# Altium schematic sheet LB-char-coilDriver.SchDoc
size A4
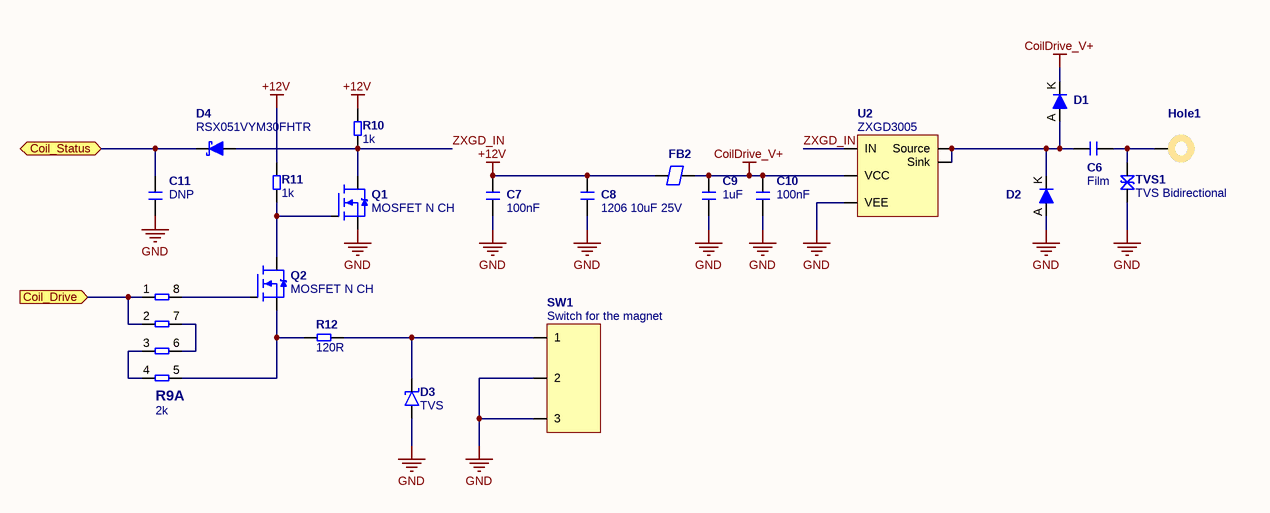
[diagram p0: LB-char-coilDriver.SchDoc]

## Parts
C6  Film  [Cap Film 5mm pitch, 7.2x7.2mm]
C7  100nF  [C0603_N]
C8  1206 10uF 25V  [C1206_N]
C9  1uF  [C0603_N]
C10  100nF  [C0603_N]
C11  DNP  [C0603_N]
D1  RSX051VYM30FHTR  [SOD323F]  (value not drawn)
D2  RSX051VYM30FHTR  [SOD323F]  (value not drawn)
D3  TVS  [SOD323F-Comchip Variant]
D4  RSX051VYM30FHTR  [SOD323F]
FB2  Ferrite Bead  [F0603_N]  (value not drawn)
Hole1  Hole  [Insert-Thread-SMD-M2]  (value not drawn)
Q1  MOSFET N CH  [SOT23_N]
Q2  MOSFET N CH  [SOT23_N]
R9  value 2k  [YC164]  (parts A,B,C,D of 4)
R10  1k  [R0603]
R11  1k  [R0603]
R12  120R  [R0603]
SW1  Switch for the magnet  [Linobyte - MagnetSwitch]
TVS1  TVS Bidirectional  [DO214AC SMA]
U2  ZXGD3005  [SOT23-6_N]

## Ports
Coil_Drive (in), Coil_Status (bidir)

## Nets
+12V: C7.1 C8.1 FB2.2 R10.2 R11.2
CoilDrive_V+: C9.1 C10.1 D1.K FB2.1 U2.1(VCC)
GND: C7.2 C8.2 C9.2 C10.2 C11.2 D2.A D3.1 Q1.3(S) SW1.2 SW1.3 TVS1.2 U2.3(VEE)
Coil_Drive: R9.1 R9.2 ; port Coil_Drive
Coil_Status: C11.1 D4.K ; port Coil_Status
ZXGD_IN: D4.A Q1.2(D) R10.1 U2.2(IN)
NetC6_1: C6.1 Hole1.1 TVS1.1
NetC6_2: C6.2 D1.A D2.K U2.4(Sink) U2.6(Source)
NetD3_2: D3.2 R12.2 SW1.1
NetQ1_1: Q1.1(G) Q2.2(D) R11.1
NetQ2_1: Q2.1(G) R9.8
NetQ2_3: Q2.3(S) R9.5 R12.1
NetR9_3: R9.3 R9.4
NetR9_6: R9.6 R9.7

## Library data of the parts
C6 = Capacitor - Film
C7-C11 = Capacitor: Capacitor MLCC; Manufacturer: Yageo; Manufacturer Part Number: CC0603KRX7R9BB104; Tolerance (%): 10; Category: Capacitor; Package: 0603; Supplier Part Number 1: 1362556; Supplier 1: Farnell; ComponentLink1URL: http://www.yageo.com; ComponentLink1Description: Manufacturer Website; Voltage Rating (Volts): *; Supplier 2: Digi-Key; Supplier Part Number 2: 311-1344-1-ND
  C7 C10: Value: 100nF
  C8 C9: Value: *
  C11: Value: DNP
D1 D2 = Diode
D4 = Diode Schottky
R9 = Resistor Array - 4P
R10-R12 = Resistor: Published: 17-Dec-2003; LatestRevisionDate: 19-Mar-2004; LatestRevisionNote: Silkscreen size reduced.; PackageDocument: Mar-2003; PackageReference: 3-0603; Publisher: Altium Limited; Code_IPC: 1608 [0603]; ComponentLink1Description: Manufacturer Link; ComponentLink1URL: http://www.panasonic.com/industrial/components/resistive_products.htm; ComponentLink2Description: Datasheet; ComponentLink2URL: http://www.panasonic.com/industrial/components/pdf/AOA0000CE2.pdf
  R10 R11: Value: 1k
  R12: Value: 120R
SW1 = Linobyte - MagnetSwitch